# Altium schematic sheet Sheet1.SchDoc
size A
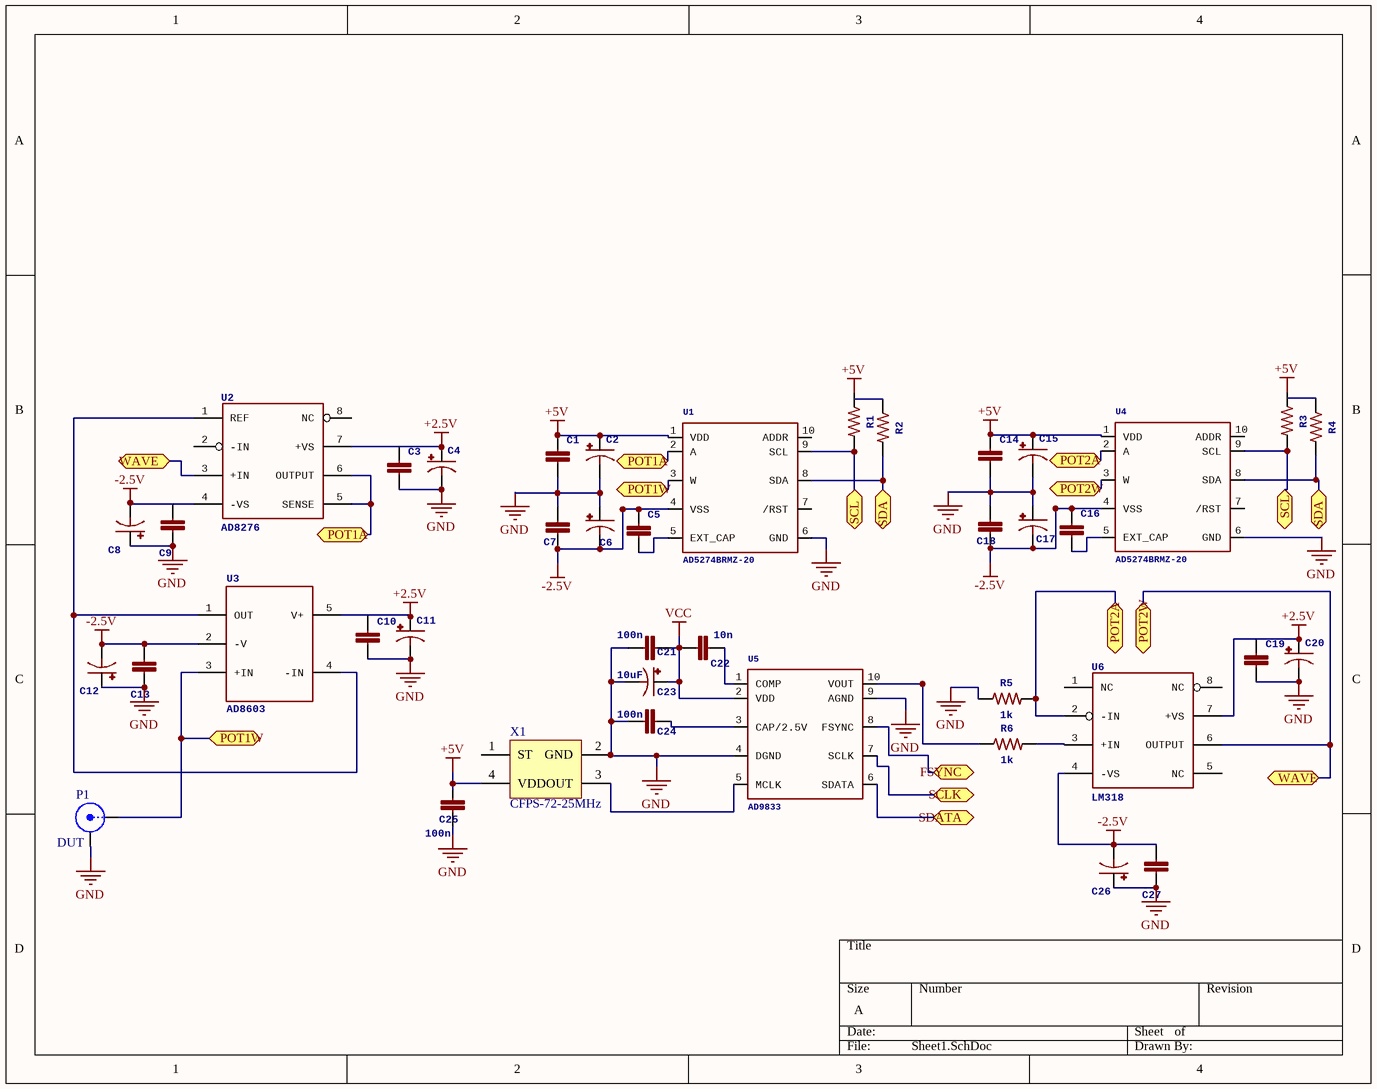
[diagram p0: Sheet1.SchDoc]

## Parts
C1  (no value)  [0603]
C2  (no value)  [EIA3528]
C3  (no value)  [0603]
C4  (no value)  [EIA3528]
C5  (no value)  [0603]
C6  (no value)  [EIA3528]
C7  (no value)  [0603]
C8  (no value)  [EIA3528]
C9  (no value)  [0603]
C10  (no value)  [0603]
C11  (no value)  [EIA3528]
C12  (no value)  [EIA3528]
C13  (no value)  [0603]
C14  (no value)  [0603]
C15  (no value)  [EIA3528]
C16  (no value)  [0603]
C17  (no value)  [EIA3528]
C18  (no value)  [0603]
C19  (no value)  [0603]
C20  (no value)  [EIA3528]
C21  100n  [0603]
C22  10n  [0603]
C23  10uF  [EIA3528]
C24  100n  [0603]
C25  100n  [0603]
C26  (no value)  [EIA3528]
C27  (no value)  [0603]
P1  DUT  [BNC_RA CON]
R1  (no value)  [0805]
R2  (no value)  [0805]
R3  (no value)  [0805]
R4  (no value)  [0805]
R5  1k  [0805]
R6  1k  [0805]
U1  AD5274BRMZ-20  [TFSOP-10]
U2  AD8276  [SO08]
U3  AD8603  [SOT23-5L]
U4  AD5274BRMZ-20  [TFSOP-10]
U5  AD9833  [TFSOP-10]
U6  LM318  [SO08]
X1  CFPS-72-25MHz  [D-46_6A]

## Ports
FSYNC (bidir), POT1A (bidir), POT1W (bidir), POT2A (bidir), POT2W (bidir), SCL (bidir), SCLK (bidir), SDA (bidir), SDATA (bidir), WAVE (bidir)

## Nets
+2.5V: C3.1 C4.A(+) C11.A(+) C19.1 C20.A(+) U2.7(+VS) U3.5(V+) U6.7(+VS)
+5V: C1.1 C2.A(+) C14.1 C15.A(+) C25.2 R1.1 R3.1 U1.1(VDD) U4.1(VDD) X1.4(VDD)
-2.5V: C5.1 C6.C(-) C7.1 C8.C(-) C9.2 C12.C(-) C13.2 C16.1 C17.C(-) C18.1 C26.C(-) C27.2 U1.4(VSS) U2.4(-VS) U3.2(-V) U4.4(VSS) U6.4(-VS)
GND: C1.2 C2.C(-) C3.2 C4.C(-) C6.A(+) C7.2 C8.A(+) C9.1 C10.2 C11.C(-) C12.A(+) C13.1 C14.2 C15.C(-) C17.A(+) C18.2 C19.2 C20.C(-) C21.2 C23.C(-) C24.2 C25.1 C26.A(+) C27.1 P1.2(Y) R5.1 U1.6(GND) U4.6(GND) U5.4(DGND) U5.9(AGND) X1.2(GND)
VCC: C21.1 C22.2 C23.A(+) U5.2(VDD)
FSYNC: U5.8(FSYNC) ; port FSYNC
POT1A: U1.2(A) U2.5(SENSE) U2.6(OUTPUT) ; port POT1A
POT1W: P1.1(X) U1.3(W) U3.3(+IN) ; port POT1W
POT2A: R5.2 U4.2(A) U6.2(-IN) ; port POT2A
POT2W: U2.3(+IN) U4.3(W) U6.6(OUTPUT) ; port POT2W, port WAVE
SCL: R1.2 R3.2 U1.9(SCL) U4.9(SCL) ; port SCL
SCLK: U5.7(SCLK) ; port SCLK
SDA: R2.2 R4.2 U1.8(SDA) U4.8(SDA) ; port SDA
SDATA: U5.6(SDATA) ; port SDATA
NetC5_2: C5.2 U1.5(EXT_CAP)
NetC16_2: C16.2 U4.5(EXT_CAP)
NetC22_1: C22.1 U5.1(COMP)
NetC24_1: C24.1 U5.3(CAP/2.5V)
NetR6_1: R6.1 U5.10(VOUT)
NetR6_2: R6.2 U6.3(+IN)
NetU2_1: U2.1(REF) U3.1(OUT) U3.4(-IN)
NetU5_5: U5.5(MCLK) X1.3(OUT)

Not connected (* = marked no-connect by the designer): C10 1; R2 1; R4 1; U1 7(/RST) 10(ADDR); U2 2(-IN) 8(NC); U4 7(/RST) 10(ADDR); U6 1(NC) 5(NC) 8(NC); X1 1(ST)

## Library data of the parts
C1 C3 C5 C7 C9 C10 C13 C14 C16 C18 C19 C21 C22 C24 C25 C27 = 0.1UF-0603-25V-(+80/-20%): PROD_ID: CAP-00810
C2 C4 C6 C8 C11 C12 C15 C17 C20 C23 C26 = 68UF-POLAR-EIA3528-10V-10%(TANT): PROD_ID: CAP-10790
P1 = BNC: BNC Elbow Connector; LatestRevisionDate: 17-Jul-2002; LatestRevisionNote: Re-released for DXP Platform.; Publisher: Altium Limited
R1-R6 = RESISTOR0805
U1 U4 U5 = LM4853: PROD_ID: IC-13812
U2 U6 = LM3622
U3 = LP298XS
X1 = Bridge2: Diode Bridge; Published: 24-Mar-1999; LatestRevisionDate: 17-Jul-2002; LatestRevisionNote: Re-released for DXP Platform.; PackageReference: D-46_6A; Publisher: Altium Limited; PackageDescription: Bridge Rectifier; 4 Terminals; Body 16.8 x 16.8 mm (typ); Pitch 10.67 mm